# EAGLE schematic 16F7167segadc (EAGLE 9.3.1)
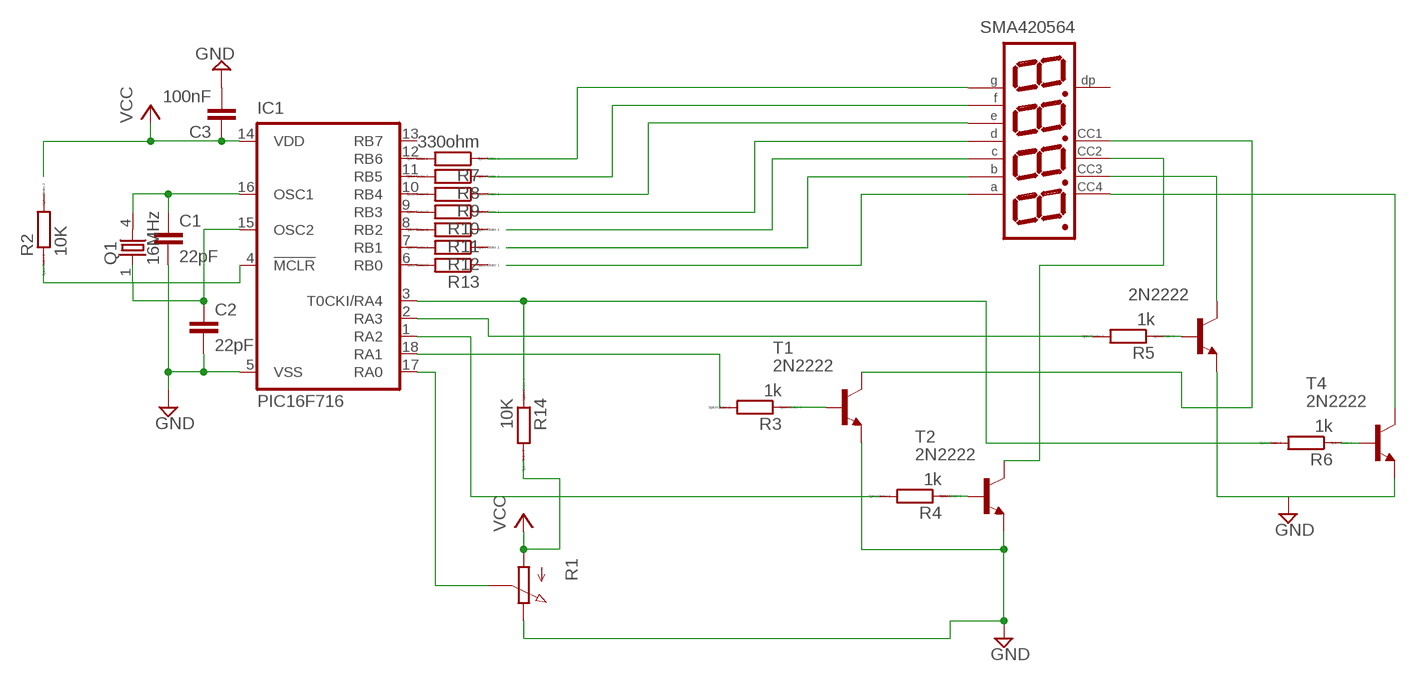
[diagram p0: schematic, sheet 1]

## Parts
C1  22pF  C2,5-3  [C2.5-3]
C2  22pF  C2,5-3  [C2.5-3]
C3  100nF  C2,5-3  [C2.5-3]
IC1  PIC16F716  PIC16F83P  [DIL18]
Q1  16MHz  86SMX  [86SMX]
R1  PC25  [PC25]
R2  10K  R0204/7  [0204/7]
R3  1k  R0204/7  [0204/7]
R4  1k  R0204/7  [0204/7]
R5  1k  R0204/7  [0204/7]
R6  1k  R0204/7  [0204/7]
R7  330ohm  R0204/7  [0204/7]
R8  R0204/7  [0204/7]
R9  R0204/7  [0204/7]
R10  R0204/7  [0204/7]
R11  R0204/7  [0204/7]
R12  R0204/7  [0204/7]
R13  R0204/7  [0204/7]
R14  10K  R0204/7  [0204/7]
SMA420564  NFD-5641AS  [NFD-5641]
T1  2N2222  [TO18]
T2  2N2222  [TO18]
T3  2N2222  [TO18]
T4  2N2222  [TO18]

## Nets
GND: C1.2 C2.2 C3.2 IC1.5(VSS) R1.E T1.1(E) T2.1(E) T3.1(E) T4.1(E)
N$1: C1.1 IC1.16(OSC1) Q1.4
N$2: SMA420564.P$9 T2.3(C)
N$3: C2.1 IC1.15(OSC2) Q1.1
N$4: IC1.4(!MCLR) R2.1
N$5: SMA420564.P$12 T1.3(C)
N$6: IC1.12(RB6) R7.2
N$7: IC1.17(RA0) R1.S
N$8: IC1.3(T0CKI/RA4) R6.2 R14.1
N$9: R8.1 SMA420564.P$10
N$10: R7.1 SMA420564.P$5
N$11: IC1.2(RA3) R5.2
N$12: R5.1 T3.2(B)
N$13: R6.1 T4.2(B)
N$14: IC1.1(RA2) R4.2
N$15: R4.1 T2.2(B)
N$16: IC1.18(RA1) R3.2
N$17: R3.1 T1.2(B)
N$18: IC1.11(RB5) R8.2
N$19: IC1.10(RB4) R9.2
N$20: IC1.9(RB3) R10.2
N$21: IC1.8(RB2) R11.2
N$22: IC1.7(RB1) R12.2
N$23: IC1.6(RB0) R13.2
N$25: SMA420564.P$6 T4.3(C)
N$26: SMA420564.P$11
N$27: SMA420564.P$7
N$28: R9.1 SMA420564.P$1
N$29: SMA420564.P$4
N$30: R10.1 SMA420564.P$2
N$31: SMA420564.P$8 T3.3(C)
VCC: C3.1 IC1.14(VDD) R1.A R14.2
Unconnected: IC1.13(RB7) R2.2 R11.1 R12.1 R13.1 SMA420564.P$3

## Library data of the parts
C1-C3 = capacitor-wima:C: CAPACITOR naming: grid - package width
IC1 = microchip:PIC16F8*: MICROCONTROLLER 8-Bit PIC16F8X Family - CMOS Flash/EEPROM Pin Compatible : PIC16F83, PIC16CR83, PIC16F84A, PIC16CR84 see also PIC16C*
Q1 = crystal:86SMX: CRYSTAL; MF: C-MAC FREQUENCY PRODUCTS LTD; MPN: XTAL003321- 86SMX; OC_FARNELL: 6344914; OC_NEWARK: 01H9866
R1 = pot-vitrohm:PC25: VITROHM POTENTIOMETER; MF: CLAROSTAT; MPN: 308NPC25KS; OC_FARNELL: 1440998; OC_NEWARK: 03F7518
R2-R14 = eagle-ltspice:R: RESISTOR, European symbol; SPICEMODEL: NONE; SPICEPREFIX: R
SMA420564 = display-nfd:NFD-5641AS: Four Digit 0.56" CC Seven-Segment LED Display Futurlec part number: 7FR5641AS Created by RobG
T1-T4 = transistor:2N2222: NPN TRANSISTOR